# EAGLE design Ver.5 MD Nch (EAGLE 9.6.2)
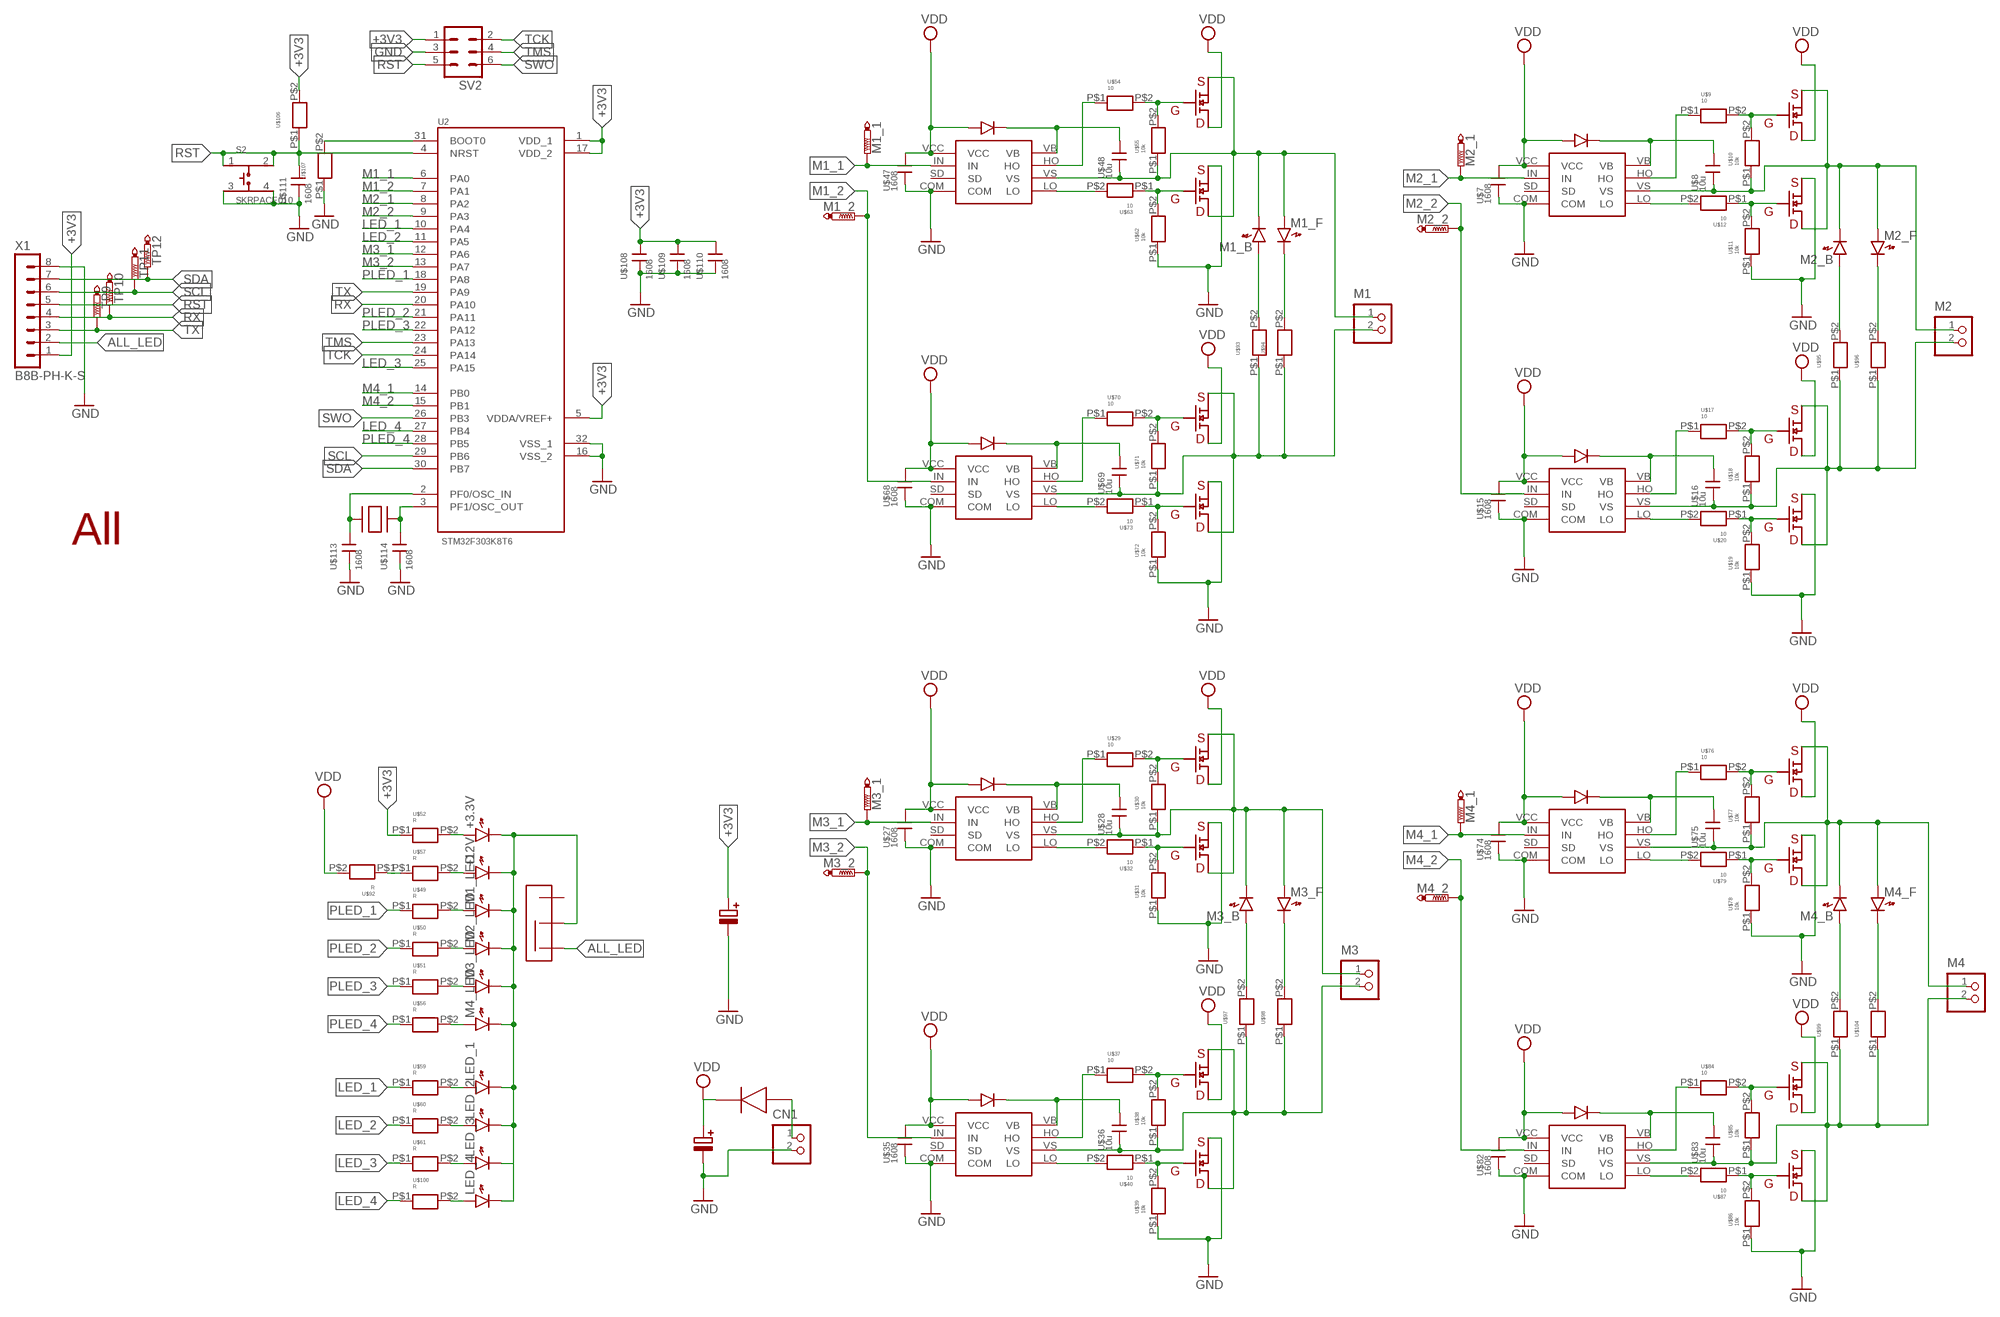
[diagram p0: schematic, sheet 1]

## Parts
+3.3V  LED1608  [LED1608]
+12V  LED1608  [LED1608]
CN1  B2B-XH-A  [B2B-XH-A]
LED_1  LED1608  [LED1608]
LED_2  LED1608  [LED1608]
LED_3  LED1608  [LED1608]
LED_4  LED1608  [LED1608]
M1  S2B-XH-A  [S2B-XH-A]
M1_1  PTR1B1,27  [B1,27]
M1_2  PTR1B1,27  [B1,27]
M1_B  LED1608  [LED1608]
M1_F  LED1608  [LED1608]
M1_LED  LED1608  [LED1608]
M2  S2B-XH-A  [S2B-XH-A]
M2_1  PTR1B1,27  [B1,27]
M2_2  PTR1B1,27  [B1,27]
M2_B  LED1608  [LED1608]
M2_F  LED1608  [LED1608]
M2_LED  LED1608  [LED1608]
M3  S2B-XH-A  [S2B-XH-A]
M3_1  PTR1B1,27  [B1,27]
M3_2  PTR1B1,27  [B1,27]
M3_B  LED1608  [LED1608]
M3_F  LED1608  [LED1608]
M3_LED  LED1608  [LED1608]
M4  S2B-XH-A  [S2B-XH-A]
M4_1  PTR1B1,27  [B1,27]
M4_2  PTR1B1,27  [B1,27]
M4_B  LED1608  [LED1608]
M4_F  LED1608  [LED1608]
M4_LED  LED1608  [LED1608]
S2  SKRPACE010  [SW_SKRPACE010]
SV2  ML6  [ML6]
TP9  PTR1B1,27  [B1,27]
TP10  PTR1B1,27  [B1,27]
TP11  PTR1B1,27  [B1,27]
TP12  PTR1B1,27  [B1,27]
U2  STM32F303K8T6  [QFP80P900X900X160-32N]
U$1  SSM6K8  [SSM6K8]
U$2  SSM6K8  [SSM6K8]
U$3  SSM6K8  [SSM6K8]
U$4  SSM6K8  [SSM6K8]
U$5  IR2302  [IR2302]
U$6  1N4148  [1N4148]
U$7  1608  [CON]
U$8  10u  1608  [CON]
U$9  10  R  [1608]
U$10  10k  R  [1608]
U$11  10k  R  [1608]
U$12  10  R  [1608]
U$13  IR2302  [IR2302]
U$14  1N4148  [1N4148]
U$15  1608  [CON]
U$16  10u  1608  [CON]
U$17  10  R  [1608]
U$18  10k  R  [1608]
U$19  10k  R  [1608]
U$20  10  R  [1608]
U$21  SSM6K8  [SSM6K8]
U$22  SSM6K8  [SSM6K8]
U$23  SSM6K8  [SSM6K8]
U$24  SSM6K8  [SSM6K8]
U$25  IR2302  [IR2302]
U$26  1N4148  [1N4148]
U$27  1608  [CON]
U$28  10u  1608  [CON]
U$29  10  R  [1608]
U$30  10k  R  [1608]
U$31  10k  R  [1608]
U$32  10  R  [1608]
U$33  IR2302  [IR2302]
U$34  1N4148  [1N4148]
U$35  1608  [CON]
U$36  10u  1608  [CON]
U$37  10  R  [1608]
U$38  10k  R  [1608]
U$39  10k  R  [1608]
U$40  10  R  [1608]
U$41  SSM6K8  [SSM6K8]
U$42  SSM6K8  [SSM6K8]
U$43  SSM6K8  [SSM6K8]
U$44  SSM6K8  [SSM6K8]
U$45  IR2302  [IR2302]
U$46  1N4148  [1N4148]
U$47  1608  [CON]
U$48  10u  1608  [CON]
U$49  R  [1608]
U$50  R  [1608]
U$51  R  [1608]
U$52  R  [1608]
U$53  SSW  [SSW]
U$54  10  R  [1608]
U$55  10k  R  [1608]
U$56  R  [1608]
U$57  R  [1608]
U$58  25V100  [25V100]
U$59  R  [1608]
U$60  R  [1608]
U$61  R  [1608]
U$62  10k  R  [1608]
U$63  10  R  [1608]
U$64  IR2302  [IR2302]
U$65  1N4148  [1N4148]
U$66  IR2302  [IR2302]
U$67  1N4148  [1N4148]
U$68  1608  [CON]
U$69  10u  1608  [CON]
U$70  10  R  [1608]
U$71  10k  R  [1608]
U$72  10k  R  [1608]
U$73  10  R  [1608]
U$74  1608  [CON]
U$75  10u  1608  [CON]
U$76  10  R  [1608]
U$77  10k  R  [1608]
U$78  10k  R  [1608]
U$79  10  R  [1608]
U$80  IR2302  [IR2302]
U$81  1N4148  [1N4148]
U$82  1608  [CON]
U$83  10u  1608  [CON]
U$84  10  R  [1608]
U$85  10k  R  [1608]
U$86  10k  R  [1608]
U$87  10  R  [1608]
U$88  SSM6K8  [SSM6K8]
U$89  SSM6K8  [SSM6K8]
U$90  SSM6K8  [SSM6K8]
U$91  SSM6K8  [SSM6K8]
U$92  R  [1608]
U$93  R  [1608]
U$94  R  [1608]
U$95  R  [1608]
U$96  R  [1608]
U$97  R  [1608]
U$98  R  [1608]
U$99  R  [1608]
U$100  R  [1608]
U$101  25V100  [25V100]
U$102  40V5A  [40V5A]
U$103  ALL  [ALL]
U$104  R  [1608]
U$106  R  [1608]
U$107  R  [1608]
U$108  1608  [CON]
U$109  1608  [CON]
U$110  1608  [CON]
U$111  1608  [CON]
U$112  SUISYOU  [水晶]
U$113  1608  [CON]
U$114  1608  [CON]
X1  B8B-PH-K-S  [B8B-PH-K-S]

## Nets
+3V3 [New Class]: SV2.1 U2.1(VDD_1) U2.5(VDDA/VREF+) U2.17(VDD_2) U$52.P$1 U$58.P$1 U$106.P$2 U$108.P$1 U$109.P$1 U$110.P$1 X1.1
ALL_LED [New Class]: U$53.P$1 X1.2
GND [New Class]: CN1.2 S2.3 S2.4 SV2.3 U2.16(VSS_2) U2.32(VSS_1) U$2.S U$4.S U$5.COM U$7.P$2 U$11.P$1 U$13.COM U$15.P$2 U$19.P$1 U$22.S U$24.S U$25.COM U$27.P$2 U$31.P$1 U$33.COM U$35.P$2 U$39.P$1 U$42.S U$44.S U$45.COM U$47.P$2 U$58.P$2 U$62.P$1 U$64.COM U$66.COM U$68.P$2 U$72.P$1 U$74.P$2 U$78.P$1 U$80.COM U$82.P$2 U$86.P$1 U$89.S U$91.S U$101.P$2 U$107.P$1 U$108.P$2 U$109.P$2 U$110.P$2 U$111.P$2 U$113.P$2 U$114.P$2 X1.8
LED_1: U2.10(PA4) U$59.P$1
LED_2: U2.11(PA5) U$60.P$1
LED_3: U2.25(PA15) U$61.P$1
LED_4: U2.27(PB4) U$100.P$1
M1_1 [New Class]: M1_1.TP U2.6(PA0) U$45.IN
M1_2 [New Class]: M1_2.TP U2.7(PA1) U$66.IN
M2_1 [New Class]: M2_1.TP U2.8(PA2) U$5.IN
M2_2 [New Class]: M2_2.TP U2.9(PA3) U$13.IN
M3_1 [New Class]: M3_1.TP U2.12(PA6) U$25.IN
M3_2 [New Class]: M3_2.TP U2.13(PA7) U$33.IN
M4_1 [New Class]: M4_1.TP U2.14(PB0) U$64.IN
M4_2 [New Class]: M4_2.TP U2.15(PB1) U$80.IN
N$1: M1.2 U$3.S U$4.D U$4.DD(D) U$4.DDD(D) U$4.DDDD(D) U$66.VS U$69.P$2 U$71.P$1 U$93.P$1 U$94.P$1
N$2: U$5.VB U$6.P$2 U$8.P$1
N$3: M2.1 M2_B.K M2_F.A U$5.VS U$8.P$2 U$10.P$1 U$21.S U$22.D U$22.DD(D) U$22.DDD(D) U$22.DDDD(D)
N$4: U$9.P$2 U$10.P$2 U$21.G
N$5: M1_LED.A U$49.P$2
N$6: U$5.HO U$9.P$1
N$7: U$5.LO U$12.P$2
N$8: U$11.P$2 U$12.P$1 U$22.G
N$9: U$13.VB U$14.P$2 U$16.P$1
N$10: U$17.P$2 U$18.P$2 U$23.G
N$11: U$13.HO U$17.P$1
N$12: U$13.LO U$20.P$2
N$13: U$19.P$2 U$20.P$1 U$24.G
N$14: M2.2 U$13.VS U$16.P$2 U$18.P$1 U$23.S U$24.D U$24.DD(D) U$24.DDD(D) U$24.DDDD(D) U$95.P$1 U$96.P$1
N$15: U$25.VB U$26.P$2 U$28.P$1
N$16: M3.1 M3_B.K M3_F.A U$25.VS U$28.P$2 U$30.P$1 U$41.S U$42.D U$42.DD(D) U$42.DDD(D) U$42.DDDD(D)
N$17: U$29.P$2 U$30.P$2 U$41.G
N$18: M2_LED.A U$50.P$2
N$19: U$25.HO U$29.P$1
N$20: U$25.LO U$32.P$2
N$21: M3_LED.A U$51.P$2
N$22: U$31.P$2 U$32.P$1 U$42.G
N$23: U$33.VB U$34.P$2 U$36.P$1
N$24: U$37.P$2 U$38.P$2 U$43.G
N$25: U$33.HO U$37.P$1
N$26: U$33.LO U$40.P$2
N$27: U$39.P$2 U$40.P$1 U$44.G
N$28: +3.3V.A U$52.P$2
N$29: CN1.1 U$102.P$1
N$30: +12V.A U$57.P$2
N$31: M3.2 U$33.VS U$36.P$2 U$38.P$1 U$43.S U$44.D U$44.DD(D) U$44.DDD(D) U$44.DDDD(D) U$97.P$1 U$98.P$1
N$32: U$64.VB U$65.P$2 U$75.P$1
N$33: LED_1.A U$59.P$2
N$34: M4_LED.A U$56.P$2
N$35: U$45.VB U$46.P$2 U$48.P$1
N$36: M1.1 M1_B.K M1_F.A U$1.S U$2.D U$2.DD(D) U$2.DDD(D) U$2.DDDD(D) U$45.VS U$48.P$2 U$55.P$1
N$37: LED_3.A U$61.P$2
N$38: LED_2.A U$60.P$2
N$39: U$1.G U$54.P$2 U$55.P$2
N$40: U$45.HO U$54.P$1
N$41: U$45.LO U$63.P$2
N$42: U$2.G U$62.P$2 U$63.P$1
N$43: U$66.VB U$67.P$2 U$69.P$1
N$44: M4.1 M4_B.K M4_F.A U$64.VS U$75.P$2 U$77.P$1 U$88.S U$89.D U$89.DD(D) U$89.DDD(D) U$89.DDDD(D)
N$45: U$3.G U$70.P$2 U$71.P$2
N$46: U$66.HO U$70.P$1
N$47: U$66.LO U$73.P$2
N$48: U$4.G U$72.P$2 U$73.P$1
N$49: U$76.P$2 U$77.P$2 U$88.G
N$50: U$64.HO U$76.P$1
N$51: U$64.LO U$79.P$2
N$52: U$78.P$2 U$79.P$1 U$89.G
N$53: U$80.VB U$81.P$2 U$83.P$1
N$54: U$84.P$2 U$85.P$2 U$90.G
N$55: U$80.HO U$84.P$1
N$56: U$80.LO U$87.P$2
N$57: U$86.P$2 U$87.P$1 U$91.G
N$58: M4.2 U$80.VS U$83.P$2 U$85.P$1 U$90.S U$91.D U$91.DD(D) U$91.DDD(D) U$91.DDDD(D) U$99.P$1 U$104.P$1
N$59: U$57.P$1 U$92.P$1
N$60: M1_B.A U$93.P$2
N$61: M1_F.K U$94.P$2
N$62: M2_B.A U$95.P$2
N$63: +3.3V.K +12V.K LED_1.K LED_2.K LED_3.K LED_4.K M1_LED.K M2_LED.K M3_LED.K M4_LED.K U$53.P$3
N$65: LED_4.A U$100.P$2
N$68: M3_B.A U$97.P$2
N$69: M2_F.K U$96.P$2
N$70: M4_B.A U$99.P$2
N$71: M4_F.K U$104.P$2
N$72: M3_F.K U$98.P$2
N$86: U2.31(BOOT0) U$107.P$2
N$87: U2.2(PF0/OSC_IN) U$112.P$1 U$113.P$1
N$88: U2.3(PF1/OSC_OUT) U$112.P$2 U$114.P$1
PLED_1: U2.18(PA8) U$49.P$1
PLED_2: U2.21(PA11) U$50.P$1
PLED_3: U2.22(PA12) U$51.P$1
PLED_4: U2.28(PB5) U$56.P$1
RST: S2.1 S2.2 SV2.5 U2.4(NRST) U$106.P$1 U$111.P$1 X1.5
RX: TP10.TP U2.20(PA10) X1.4
SCL: TP11.TP U2.29(PB6) X1.6
SDA: TP12.TP U2.30(PB7) X1.7
SWO: SV2.6 U2.26(PB3)
TCK: SV2.2 U2.24(PA14)
TMS: SV2.4 U2.23(PA13)
TX: TP9.TP U2.19(PA9) X1.3
VDD [New Class]: U$1.D U$1.DD(D) U$1.DDD(D) U$1.DDDD(D) U$3.D U$3.DD(D) U$3.DDD(D) U$3.DDDD(D) U$5.VCC U$6.P$1 U$7.P$1 U$13.VCC U$14.P$1 U$15.P$1 U$21.D U$21.DD(D) U$21.DDD(D) U$21.DDDD(D) U$23.D U$23.DD(D) U$23.DDD(D) U$23.DDDD(D) U$25.VCC U$26.P$1 U$27.P$1 U$33.VCC U$34.P$1 U$35.P$1 U$41.D U$41.DD(D) U$41.DDD(D) U$41.DDDD(D) U$43.D U$43.DD(D) U$43.DDD(D) U$43.DDDD(D) U$45.VCC U$46.P$1 U$47.P$1 U$64.VCC U$65.P$1 U$66.VCC U$67.P$1 U$68.P$1 U$74.P$1 U$80.VCC U$81.P$1 U$82.P$1 U$88.D U$88.DD(D) U$88.DDD(D) U$88.DDDD(D) U$90.D U$90.DD(D) U$90.DDD(D) U$90.DDDD(D) U$92.P$2 U$101.P$1 U$102.P$2
Unconnected: U$5.SD U$13.SD U$25.SD U$33.SD U$45.SD U$53.P$2 U$64.SD U$66.SD U$80.SD

## Library data of the parts
+3.3V +12V LED_1-LED_4 M1_B M1_F M1_LED M2_B M2_F M2_LED M3_B M3_F M3_LED M4_B M4_F M4_LED = generic:LED: Generic LEDs
CN1 = jst-xh:B2B-XH-A: Wire-to-Board 2.5mm pitch top mount connector Source: http://www.jst-mfg.com/product/pdf/jpn/XH.pdf http://www.jst-mfg.com/product/detail.php?series=277
M1-M4 = jst-xh:S2B-XH-A: Wire-to-Board 2.5mm pitch side mount connector Source: http://www.jst-mfg.com/product/pdf/jpn/XH.pdf http://www.jst-mfg.com/product/detail.php?series=277
M1_1 M1_2 M2_1 M2_2 M3_1 M3_2 M4_1 M4_2 TP9-TP12 = testpad:PTR1: TEST PIN
S2 = SKRPACE010:SKRPACE010: Switch Tactile N.O. SPST Button J-Bend 0.05A 16VDC 2.55N SMD Automotive T/R Check prices <https://pricing.snapeda.com/parts/SKRPACE010/ALPS/view-part?ref=eda>; AVAILABILITY: In Stock; DESCRIPTION: Switch Tactile N.O. SPST Button J-Bend 0.05A 16VDC 2.55N SMD Automotive T/R; MF: ALPS; MP: SKRPACE010; PACKAGE: None; PRICE: None
SV2 = con-ml:ML6: HARTING; OC_FARNELL: unknown; OC_NEWARK: unknown
U2 = STM32F303K8T6:STM32F303K8T6: Analog and DSP with FPU ARM Cortex-M4 MCU with 64 Kbytes Flash, 72 MHz CPU, CCM, 12-bit ADC 5 MSPS, comparators, op-amp Check availability <https://pricing.snapeda.com/parts/STM32F303K8T6/STMicroelectronics/view-part?ref=eda>; AVAILABILITY: In Stock; DESCRIPTION: ARM® Cortex®-M4 STM32F3 Microcontroller IC 32-Bit 72MHz 64KB (64K x 8) FLASH 32-LQFP (7x7); MF: STMicroelectronics; MP: STM32F303K8T6; PACKAGE: LQFP-32 STMicroelectronics; PRICE: None; PURCHASE-URL: https://pricing.snapeda.com/search/part/STM32F303K8T6/?ref=eda
U$1-U$4 U$21-U$24 U$41-U$44 U$88-U$91 = NchMOSFET SSM6K819R:SSM6K8
U$5 U$13 U$25 U$33 U$45 U$64 U$66 U$80 = IR2302:IR2302
U$6 U$14 U$26 U$34 U$46 U$65 U$67 U$81 = 1N4148:1N4148
U$7 U$8 U$15 U$16 U$27 U$28 U$35 U$36 U$47 U$48 U$68 U$69 U$74 U$75 U$82 U$83 U$108-U$111 U$113 U$114 = con1608:1608
U$9-U$12 U$17-U$20 U$29-U$32 U$37-U$40 U$49-U$52 U$54-U$57 U$59-U$63 U$70-U$73 U$76-U$79 U$84-U$87 U$92-U$100 U$104 U$106 U$107 = R 1608:R
U$53 = SSW:SSW
U$58 U$101 = 100uF25V 電解:25V100
U$102 = D40V5A:40V5A
U$103 = All_outlook:ALL
U$112 = 水晶:SUISYOU
X1 = con-JST PH:B8B-PH: JST PH series header 2.00mm pitch disconnectable crimp style connectors, vertical (side entry type), 8 pins

## Net classes
1 New Class: width 0.279 mm

## Board
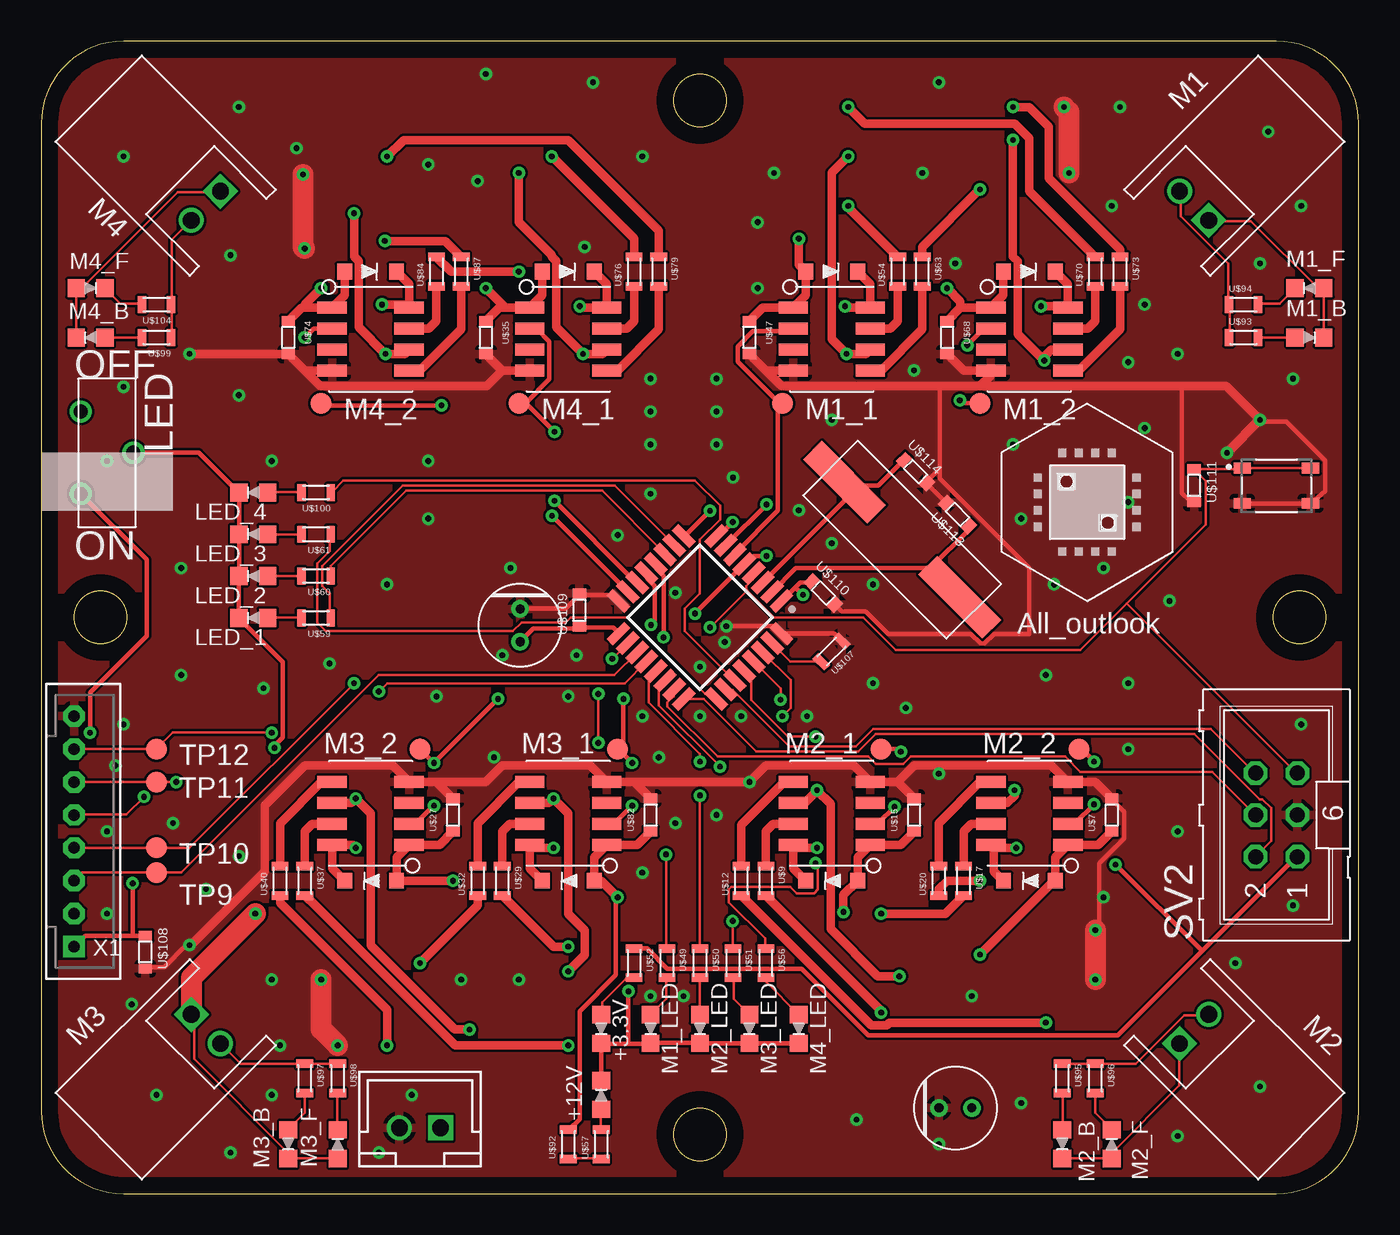
[diagram p1: board, top side]
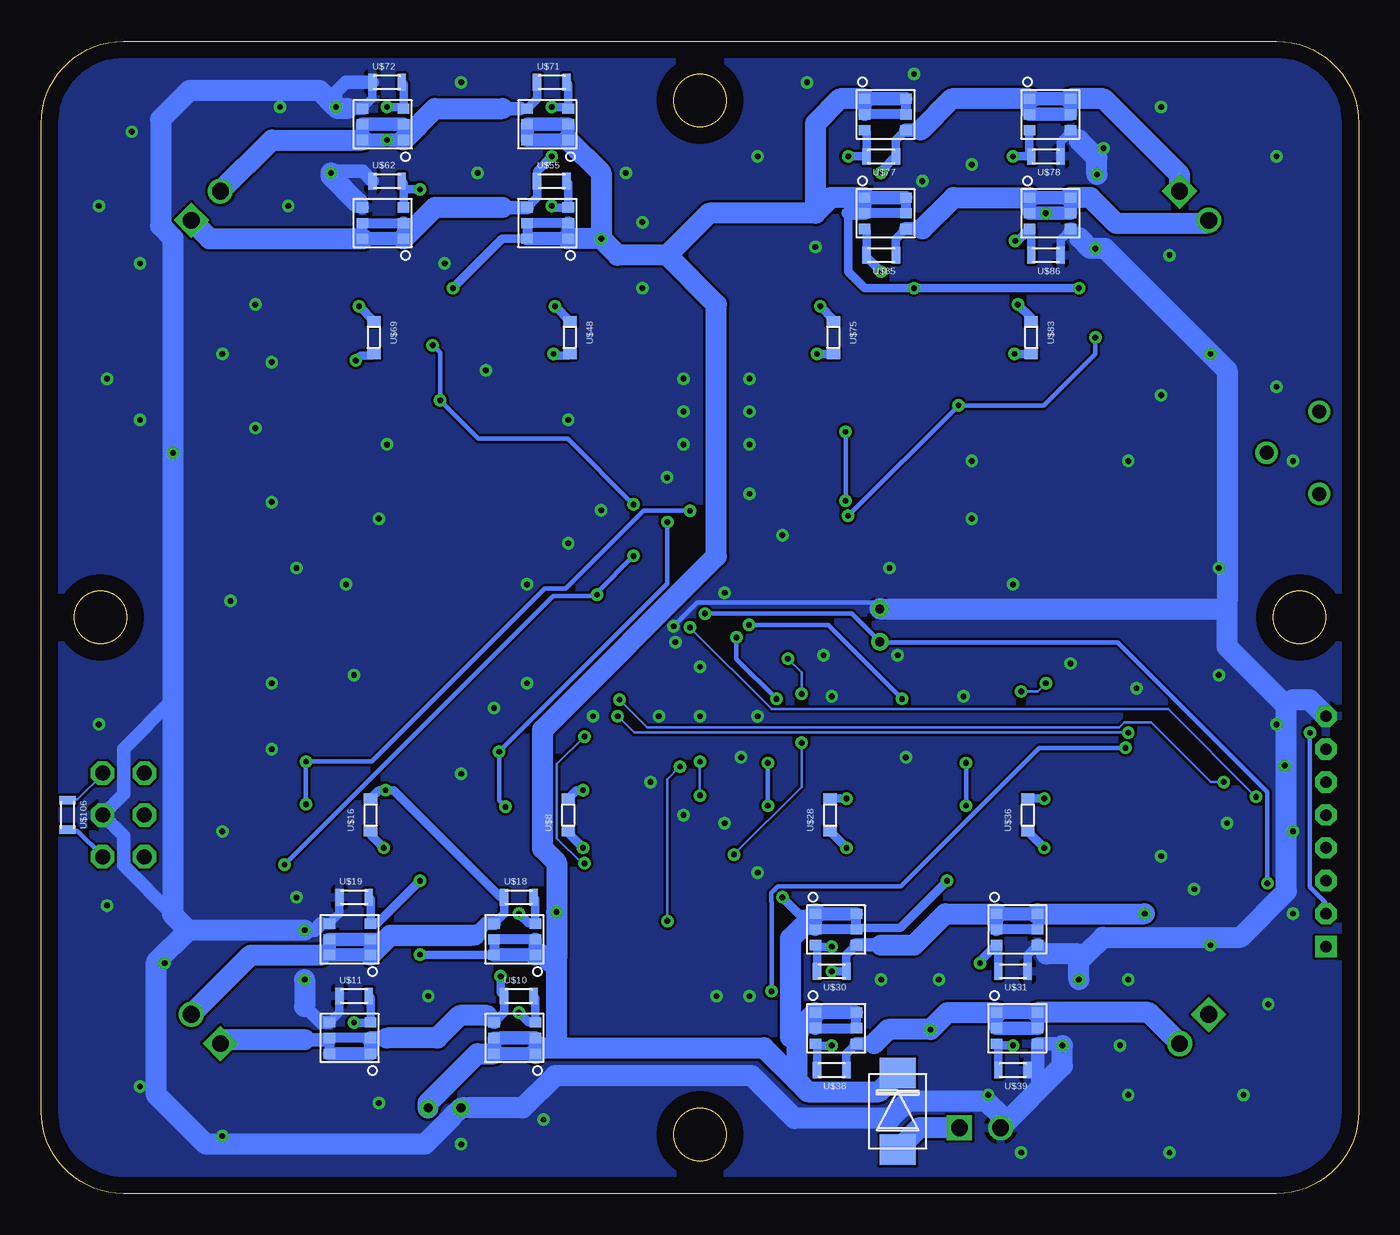
[diagram p2: board, bottom side, seen from below]

Size 80 x 70 mm. Coordinates in mm from the lower left corner, seen from the top.
Outline: 5,0 75,0 arc90 80,5 80,65 arc90 75,70 5,70 arc90 0,65 0,5 arc90 5,0
Outline: circle at 40,66.4 radius 1.6
Outline: circle at 40,3.6 radius 1.6
Outline: circle at 3.6,35 radius 1.6
Outline: circle at 76.4,35 radius 1.6
Copper layers (1*16): Top 0.035mm / dielectric 1.5mm / Bottom 0.035mm
Design rules "default": minimum track width 6mil, minimum drill 0.35mm, track to track 6mil, track to pad 6mil, pad to pad 6mil, via to via 6mil, smd to smd 6mil, copper to edge 40mil, drill to drill 6mil, minimum pad ring 10mil, minimum via ring 8mil, stop-mask expansion 4mil, vias tented up to drill 0mil, thermal gap 10mil

### Footprints (pad centres in the part's own frame; a part is rotated, then mirrored left to right if it is on the bottom)
LED1608 = smd 1.05 x 1.08: A -0.875,0; K 0.875,0
B2B-XH-A = drill 1.016 square: 1 -1.25,0 | drill 1.016: 2 1.25,0
S2B-XH-A = drill 1.016 square: 1 1.25,0 | drill 1.016: 2 -1.25,0
B1,27 = smd 1.27 x 1.27: TP 0,0
SW_SKRPACE010 = smd 1.05 x 0.65: 1 -2.075,1.075; 2 2.075,1.075; 3 -2.075,-1.075; 4 2.075,-1.075
ML6 = drill 0.914 octagon: 1 -2.54,-1.27; 2 -2.54,1.27; 3 0,-1.27; 4 0,1.27; 5 2.54,-1.27; 6 2.54,1.27
QFP80P900X900X160-32N = smd 1.5 x 0.55: 1 -4.2,2.8; 2 -4.2,2; 3 -4.2,1.2; 4 -4.2,0.4; 5 -4.2,-0.4; 6 -4.2,-1.2; 7 -4.2,-2; 8 -4.2,-2.8; 17 4.2,-2.8; 18 4.2,-2; 19 4.2,-1.2; 20 4.2,-0.4; 21 4.2,0.4; 22 4.2,1.2; 23 4.2,2; 24 4.2,2.8 | smd 0.55 x 1.5: 9 -2.8,-4.2; 10 -2,-4.2; 11 -1.2,-4.2; 12 -0.4,-4.2; 13 0.4,-4.2; 14 1.2,-4.2; 15 2,-4.2; 16 2.8,-4.2; 25 2.8,4.2; 26 2,4.2; 27 1.2,4.2; 28 0.4,4.2; 29 -0.4,4.2; 30 -1.2,4.2; 31 -2,4.2; 32 -2.8,4.2
SSM6K8 = smd 0.62 x 0.7: D 0,0; DD 0.95,0; DDD 0.95,2.5; DDDD 0,2.5; G 1.9,0; S 1.9,2.5
IR2302 = smd 1.78 x 0.72: COM -2.34,0; HO 2.34,2.54; IN -2.34,2.54; LO 2.34,0; SD -2.34,1.27; VB 2.34,3.81; VCC -2.34,3.81; VS 2.34,1.27
1N4148 = smd 0.9 x 0.95: P$1 -1.575,0; P$2 1.575,0
CON = smd 0.6 x 0.813: P$1 -1,0; P$2 1,0
1608 = smd 0.508 x 1.016: P$1 -0.889,0; P$2 0.889,0
SSW = drill 0.85: P$1 -2.5,1.6; P$2 2.5,1.6; P$3 0,-1.6
25V100 = drill 0.55: P$1 -1,0; P$2 1,0
40V5A = smd 1.85 x 2.2: P$1 -2.325,0; P$2 2.325,0
水晶 = smd 5.5 x 1.6: P$1 1.2,2.35; P$2 11.1,2.35
B8B-PH-K-S = drill 0.7 pad 1.3 square: 1 7,0 | drill 0.7 pad 1.3 octagon: 2 5,0; 3 3,0; 4 1,0; 5 -1,0; 6 -3,0; 7 -5,0; 8 -7,0

### Placement (x,y rotation side)
+3.3V  34,10 270 top
+12V  34,6 90 top
CN1  23,4 180 top
LED_1  12.88,34.97 180 top
LED_2  12.88,37.51 180 top
LED_3  12.88,40.05 180 top
LED_4  12.88,42.59 180 top
M1  70,60 315 top
M1_1  45,48 0 top
M1_2  57,48 0 top
M1_B  77,52 0 top
M1_F  77,55 180 top
M1_LED  37,10 270 top
M2  70,10 225 top
M2_1  51,27 0 top
M2_2  63,27 0 top
M2_B  62,3 270 top
M2_F  65,3 90 top
M2_LED  40,10 270 top
M3  10,10 135 top
M3_1  35,27 0 top
M3_2  23,27 0 top
M3_B  15,3 270 top
M3_F  18,3 90 top
M3_LED  43,10 270 top
M4  10,60 45 top
M4_1  29,48 180 top
M4_2  17,48 180 top
M4_B  3,52 180 top
M4_F  3,55 0 top
M4_LED  46,10 270 top
S2  75,43 0 top
SV2  75,23 90 top
TP9  7,19.5 270 top
TP10  7,21 0 top
TP11  7,25 0 top
TP12  7,27 0 top
U2  40,35 225 top
U$1  48,58 90 bottom
U$2  58,58 90 bottom
U$3  48,64 90 bottom
U$4  58,64 90 bottom
U$5  48,25 180 top
U$6  48,19 180 top
U$7  65,23 90 top
U$8  48,23 90 bottom
U$9  44,19 270 top
U$10  51,12 0 bottom
U$11  61,12 0 bottom
U$12  42.5,19 90 top
U$13  60,25 180 top
U$14  60,19 180 top
U$15  53,23 90 top
U$16  60,23 90 bottom
U$17  56,19 270 top
U$18  51,18 0 bottom
U$19  61,18 0 bottom
U$20  54.5,19 90 top
U$21  50,8.5 90 bottom
U$22  60,8.5 90 bottom
U$23  50,14.5 90 bottom
U$24  60,14.5 90 bottom
U$25  32,25 180 top
U$26  32,19 180 top
U$27  25,23 90 top
U$28  32.1,23 90 bottom
U$29  28,19 270 top
U$30  32,13.5 180 bottom
U$31  21,13.5 180 bottom
U$32  26.5,19 90 top
U$33  20,25 180 top
U$34  20,19 180 top
U$35  27,52 270 top
U$36  20.1,23 90 bottom
U$37  16,19 270 top
U$38  32,7.5 180 bottom
U$39  21,7.5 180 bottom
U$40  14.5,19 90 top
U$41  33,17 270 bottom
U$42  22,17 270 bottom
U$43  33,11 270 bottom
U$44  22,11 270 bottom
U$45  48,50 0 top
U$46  48,56 0 top
U$47  43,52 270 top
U$48  47.9,52 270 bottom
U$49  38,14 270 top
U$50  40,14 270 top
U$51  42,14 270 top
U$52  36,14 270 top
U$53  4,45 90 top
U$54  52,56 90 top
U$55  49,61.5 0 bottom
U$56  44,14 270 top
U$57  34,3 90 top
U$58  29.08,34.52 90 top
U$59  16.69,34.97 180 top
U$60  16.69,37.51 180 top
U$61  16.69,40.05 180 top
U$62  59,61.5 0 bottom
U$63  53.5,56 270 top
U$64  32,50 0 top
U$65  32,56 0 top
U$66  60,50 0 top
U$67  60,56 0 top
U$68  55,52 270 top
U$69  59.8,52 270 bottom
U$70  64,56 90 top
U$71  49,67.5 0 bottom
U$72  59,67.5 0 bottom
U$73  65.5,56 270 top
U$74  15,52 270 top
U$75  31.9,52 270 bottom
U$76  36,56 90 top
U$77  29,63 180 bottom
U$78  19,63 180 bottom
U$79  37.5,56 270 top
U$80  20,50 0 top
U$81  20,56 0 top
U$82  37,23 90 top
U$83  19.9,52 270 bottom
U$84  24,56 90 top
U$85  29,57 180 bottom
U$86  19,57 180 bottom
U$87  25.5,56 270 top
U$88  30,66.5 270 bottom
U$89  20,66.5 270 bottom
U$90  30,60.5 270 bottom
U$91  20,60.5 270 bottom
U$92  32,3 90 top
U$93  73,52 0 top
U$94  73,54 0 top
U$95  62,7 270 top
U$96  64,7 270 top
U$97  16,7 270 top
U$98  18,7 270 top
U$99  7,52 180 top
U$100  16.69,42.59 180 top
U$101  55.51,5.21 180 top
U$102  28,5 90 bottom
U$103  63.5,42 0 top
U$104  7,54 180 top
U$106  78.4,23 270 bottom
U$107  47.99,32.93 225 top
U$108  6.32,14.67 270 top
U$109  32.68,35.44 90 top
U$110  47.49,36.48 315 top
U$111  70,43 270 top
U$112  58.28,37.03 135 top
U$113  55.64,41.25 135 top
U$114  53.09,43.85 315 top
X1  2,22 270 top

### Tracks (layer width: path | path; a pad name or v marks a point on that pad's centre or on a via)
+3V3  (via drill 0.35)
  Top 0.279: 70.48,14.73 76.19,20.45 SV2.1 | 70.48,14.73 65.38,9.62 50.21,9.62 46.17,13.66 38.02,13.66 36.8,14.88 36.04,14.88 U$52.P$1 | 5.56,15.64 2.66,15.64 2.05,15.04 X1.1 | 5.56,15.64 6.32,15.64 U$108.P$1 | 45.79,36.83 U2.1 | 45.79,36.83 46.1,37.13 46.78,37.13 U$110.P$1 | U2.17 35.05,34.09 34.74,34.39 32.69,34.39 U$109.P$1 32.61,34.31 29.87,34.31 29.1,33.55 U$58.P$1 | v39.7,35.23 42.67,38.2 U2.5 42.82,38.28 43.28,38.73 v44.04,38.73 | v46.25,36.37 45.79,36.83 | v5.56,18.85 5.56,15.64 | v65.22,19.99 70.48,14.73
  Bottom 0.279: U$106.P$2 78.33,22.05 77.8,22.05 76.27,20.52 SV2.1 | v39.7,35.23 30.78,35.23 29.1,33.55 U$58.P$1 28.95,33.48 14.62,33.48 5.56,24.41 v5.56,18.85 | v44.04,38.73 46.25,36.52 v46.25,36.37 46.33,36.3 48.91,36.3 v65.22,19.99
ALL_LED  (via drill 0.35)
  Top 0.279: v2.97,27.99 2.97,30.43 6.4,33.86 6.4,38.51 U$53.P$1
  Bottom 0.279: v2.97,27.99 2.97,18.62 2.05,17.7 2.05,17.02 X1.2
GND  (via drill 0.35)
  Top 0.279: U$113.P$2 53.8,43.09 U$114.P$2 53.8,43.28 54.55,44.04 | 69.26,49.04 69.26,42.54 69.69,42.12 U$111.P$2 | v74,47 74.21,46.89 75.59,46.89 77.95,44.53 77.95,42.67 S2.4 S2.3 | U2.16 34.67,36.37 32.69,36.37 U$109.P$2 32.61,36.3 31.85,35.53 29.1,35.53 U$58.P$2 | U$108.P$2 6.4,13.74 7.46,13.74 8.76,15.04 v9,15.1 | v64,16 64.23,16.33 64.23,20.06 65.76,21.59 65.76,23.19 65.15,23.8 U$7.P$2 | v41.6,34.47 44.5,34.47 44.88,34.09 U2.32 48.16,34.01 U$107.P$1 | U$110.P$2 48.6,35.37 50.06,35.37 51.43,34 56.44,34 57.03,33.41 57.27,33.41 57.86,34 60,34 60,38 54.55,43.45 54.55,44.04 | 54.55,44.04 54.55,49.04
  Top 0.508: 24,25 U$33.COM 21.34,26 16,26 13.59,23.59 13.59,19.59 9.1,15.1 v9,15.1 | U$27.P$2 24,25 | U$25.COM 36,25 U$82.P$2 | 52,25 U$5.COM 49.34,26 44,26 v43,25 U$25.COM | 52,25 U$15.P$2 | U$7.P$2 64,25 U$13.COM 61.34,26 53,26 52,25 | 16,50 U$74.P$2 v9,51 | 16,50 U$80.COM | U$35.P$2 28,50 | 28,50 U$64.COM | U$47.P$2 44,50 | 44,50 U$45.COM | U$68.P$2 56,50 U$66.COM 57.66,49.7 57,49.04 | 24,25 27,25 28,26 33.34,26 U$25.COM | 16,50 16.96,49.04 27.04,49.04 28,50 | 44,50 44.96,49.04 54.55,49.04 57,49.04 | 57,49.04 69.26,49.04 71.96,49.04 v74,47
  Top 0.61: v74,47 v72,45
  Top 1.27: v18,9 17,10 v17,13 | v16,57.4 15.9,57.5 v15.9,61.9 | v62.1,66 62.4,65.7 v62.4,62 | v64,16 v64,13
  Bottom 0.279: 62.98,16.41 62.71,16.25 U$24.S | U$91.S 17.52,58.62 17.48,58.59 | 19.43,9.09 U$44.S | U$58.P$2 29.47,35.91 40.15,35.91 v41.6,34.47
  Bottom 0.508: U$78.P$1 18.11,63.89 17.5,64.5 U$89.S | U$86.P$1 18.11,57.96 17.48,58.59 | U$31.P$1 20.11,14.49 U$42.S | U$39.P$1 19.5,8.11 19.5,9.09 | U$19.P$1 61.89,17.01 U$24.S | U$11.P$1 61.89,11.01 U$22.S | U$72.P$1 59.89,66.53 60.5,65.91
  Bottom 0.813: 8,35.53 8,36 | 16.95,58.05 17.48,58.59 | v18,9 18.09,9.09 19.43,9.09 19.5,9.09 19.5,6.25 CN1.2 | 17,14.55 16.55,14.55 | v64,16 63.4,16 62.98,16.41 | 72.03,16.97 75,19.93 75,21.73 SV2.3 75,24.27 75,27 72,30 | 61.4,65.91 60.5,65.91 | v62.1,66 62.1,66.9 61.5,67.5 U$72.P$1 | U$62.P$1 60.49,62.1 62.3,62.1 v62.4,62 | 17.5,64.5 17,64 | 18.95,14.55 U$42.S | U$2.S 60.8,60.2 | U$22.S 63.04,10.4 | 63.04,10.4 64,11.36 | U$22.S 63.04,10.4 | 63.04,10.4 64,11.36 | U$22.S 63.04,10.4 | 63.04,10.4 64,11.36
  Bottom 1.27: U$101.P$2 50.77,5.2 48.8,7.17 36.87,7.17 34.27,4.57 28.44,4.57 27.4,5.61 22.61,5.61 21.75,4.75 CN1.2 18,7.75 v18,9 | v17,13 17,14.1 16.55,14.55 15.52,15.58 7.18,15.58 4.39,18.36 4.39,29.61 | 17,14.55 18.95,14.55 | X1.8 3,30 4,30 4.39,29.61 | U$58.P$2 8.01,35.52 8,35.53 | 4.39,29.61 8,33.22 8,36 8,50 v9,51 15.4,57.4 v16,57.4 16.3,57.4 16.95,58.05 | v15.9,61.9 15.9,62.9 17,64 | v62.4,62 62.4,61.8 60.8,60.2 | 61.4,65.91 62.02,65.91 v62.1,66 63.1,67 71,67 72.75,65.25 72.75,58.79 72,58.04 v72,45 72,30 72,17 72.03,16.97 71.07,16 | U$101.P$2 55.09,4.63 55.09,4.62 56.71,3 70,3 73,6 73,14.07 71.07,16 | v64,13 64,11.36 | v64,16 71.07,16
  other vias: 35,40 37,42.5 42,43.5 46,41.5 48,39.5 50.5,37 41.5,33.5 38.5,36.5 40,32 40,29 37.5,26.5 36.5,29 46.5,29 50.5,31 54.5,25.5 66,27 66,31 64.5,38 68.5,36 72.5,14 69,3.5 54.5,3 59.5,5.5 49.5,4.5 56.5,12 64.5,18 69,22 74,6.5 22.5,6 20.5,2.5 11.5,2.5 14,6 14.5,9 14,13 7,6 5.5,11.5 10,18.5 25.5,13 29,13 36.5,19.5 38.5,22.5 41,23 37,12 39,12 42.5,29 27.5,26.5 12,20.5 4,17 4,22 8,22.5 4.5,26 5,28.5 8.5,31.5 8.5,38 21,37 28.5,38 23.5,41 23.5,44.5 14,44.5 4,44.5 5,49 12,48.5 11.5,57 5,63 12,66 15.5,63.5 23.5,62.5 27,68 33.5,67.5 36.5,63 33,57.5 26.5,61.5 37,49.5 37,47.5 37,45.5 41,45.5 41,47.5 41,49.5 48,47 53,50 66,50.5 67,54 65,60 53.5,62 55.5,56.5 44.5,62 43.5,59 43.5,55 54.5,67.5 65.5,66 74.5,64.5 76.5,60 74,56.5 76,49.5 69,51 67,46.5 59,45.5 66,42 59.5,41 61.5,37 61,31.5 76.5,28.5 76,17.5 52.5,29.5 24,30.2 17.5,32.2 13.5,30.7 32,30.2 32.5,32.7 28,32.7
  pour Bottom: 0,0 0,70 80,70 80,0
  pour Top: 0,70 0,0 80,0 80,70
LED_1
  Top 0.152: U$59.P$1 17.52,35 17.52,36.45 17.06,36.91 17.06,38.12 21.94,43 34.82,43 38.4,39.42 U2.10
LED_2
  Top 0.152: U$60.P$1 17.58,38.12 22.16,42.7 34.06,42.7 37.87,38.89 U2.11
LED_3
  Top 0.152: U$61.P$1 17.52,40.03 17.52,39.04 16.76,38.28 16.76,34.7 17.29,34.16 28.65,34.16 29.18,34.7 31.85,34.7 32.15,35 35.66,35 40.3,30.35 40.69,30.35 40.91,30.12 U2.25
LED_4
  Top 0.152: U$100.P$1 17.6,42.62 17.66,42.62 18.35,43.31 39.7,43.31 41.22,41.78 41.22,40.94 40,39.72 40,36.45 39.09,35.53 39.09,34.16 42.06,31.19 U2.27
M1_1
  Top 0.279: U$45.IN 45.64,52.53 45.49,52.37 43.2,52.37 42.29,51.46 42.29,50.55 44.8,48.03 44.95,48.03 M1_1.TP 44.72,47.95 44.72,41.48 42.13,38.89 U2.6
M1_2  (via drill 0.35)
  Top 0.279: v55.77,48.18 55.93,48.03 56.99,48.03 M1_2.TP | v56.23,51.53 57.22,52.53 57.6,52.53 U$66.IN | v44.04,41.86 41.6,39.42 U2.7
  Bottom 0.279: v56.23,51.53 55.77,51.08 v55.77,48.18 53.45,45.86 48.04,45.86 v44.04,41.86
M2_1  (via drill 0.35)
  Top 0.279: v52.19,26.85 52.04,27 51.05,27 M2_1.TP | v51.81,23.49 50.82,22.5 50.36,22.5 U$5.IN | v41.98,40.79 41.14,39.95 U2.8
  Bottom 0.279: v51.81,23.49 52.19,23.88 v52.19,26.85 41.98,37.06 v41.98,40.79
M2_2  (via drill 0.35)
  Top 0.279: v63.93,26.24 63.16,27 63.01,27 M2_2.TP | v63.93,23.65 62.78,22.5 62.4,22.5 U$13.IN | v40.61,41.48 39.09,39.95 U2.9
  Bottom 0.279: v63.93,23.65 v63.93,26.24 59.93,26.24 49.41,36.75 48.15,36.75 43.43,41.48 v40.61,41.48
M3_1  (via drill 0.35)
  Top 0.279: v35.88,26.16 35.05,27 M3_1.TP 35.12,27.07 35.35,27.3 v35.35,30.05 | v35.88,23.57 34.82,22.5 34.36,22.5 U$25.IN | v37.79,33.78 37.79,37.52 37.33,37.97 37.33,38.2 U2.12
  Bottom 0.279: v35.88,23.57 v35.88,26.16 | v37.79,33.78 37.79,32.48 v35.35,30.05
M3_2  (via drill 0.35)
  Top 0.279: v23.85,23.57 22.78,22.5 22.4,22.5 U$33.IN | M3_2.TP v23.85,26.16 v27.73,30.05 | v37.03,34.54 37.26,34.77 37.26,36.91 36.8,37.36 36.8,37.67 U2.13
  Bottom 0.279: v23.85,23.57 v23.85,26.16 | v37.03,34.54 32.23,34.54 v27.73,30.05
M4_1  (via drill 0.35)
  Top 0.279: U$64.IN 29.71,52.53 30.09,52.53 30.86,51.76 30.86,49.48 29.41,48.03 29.03,48.03 M4_1.TP 29.48,47.95 v31.16,46.28 | v31.16,42.09 36.11,37.13 U2.14
  Bottom 0.279: v31.16,46.28 v31.16,42.09
M4_2  (via drill 0.35)
  Top 0.279: v31.01,41.17 35.58,36.6 U2.15 | 17.06,47.88 v24.3,47.88 | v16,52 16.54,52.54 U$80.IN
  Top 0.508: M4_2.TP 17.06,47.94 17.06,47.88
  Bottom 0.279: v31.01,41.17 v24.3,47.88 19.12,47.88 16,51 v16,52
N$1  (via drill 0.35)
  Top 0.152: U$93.P$1 72.16,52.07 72.16,53.97 U$94.P$1 72.08,54.05 72.08,56.49 69.19,59.38 69.19,60.83 M1.2
  Top 0.508: U$66.VS 61.34,51.27 60.9,50.83 v60.9,50.6 59.28,52.22 59.28,56.64 59,56.92 v59,64
  Bottom 0.508: U$71.P$1 49.89,66.51 U$3.S 50.52,65.91 50.9,65.91 | v60.9,50.6 60.6,50.9 59.9,50.9 U$69.P$2
  Bottom 0.813: 52,65.9 50.91,65.9 50.9,65.91 | U$4.D U$4.DD U$4.DDD U$4.DDDD v59,64 U$4.D
  Bottom 1.27: 52,65.9 56.1,65.9 U$4.D | M1.2 66,64 U$4.DDDD
N$2  (via drill 0.35)
  Top 0.508: U$6.P$2 45.66,19.77 U$5.VB 45.85,21 v47.1,21
  Bottom 0.508: U$8.P$1 48,21.9 v47.1,21
N$3  (via drill 0.35)
  Top 0.152: M2_B.K 62.02,2.16 64.99,2.16 M2_F.A 64.99,2.23 64.99,2.46 69.11,6.58 69.11,9.09 M2.1
  Top 0.508: U$5.VS 46.36,23.73 47.1,24.47 v47.1,24.5 47.93,23.67 47.93,16.07 50.8,13.2 v52.1,13.2
  Bottom 0.508: U$21.S 51.89,11.01 U$10.P$1 52.1,12.21 v52.1,13.2 | v47.1,24.5 47.5,24.5 U$8.P$2 | U$22.DDD 62.6,9.35
  Bottom 0.61: U$22.DD U$22.DDD U$22.DDDD
  Bottom 0.813: U$21.S 52.92,10.82 | 55.95,9.45 56,9.45 | 59,9.45 U$22.DD | U$22.DD 60.1,9.35 | U$22.DDDD U$22.D U$22.DD | 62.6,9.35 64,9.35
  Bottom 1.27: 52.92,10.82 54.58,10.82 55.95,9.45 | 56,9.45 59,9.45 | 64,9.35 68.88,9.35 M2.1
N$4  (via drill 0.35)
  Top 0.508: U$9.P$2 51,11.11 v51,11
  Bottom 0.508: U$10.P$2 50,11.89 U$21.G 50.4,10.4 v51,11
N$5
  Top 0.152: U$49.P$2 37.94,13.05 37.94,11.84 37.03,10.92 M1_LED.A
N$6
  Top 0.508: U$9.P$1 44,22 44.46,22.46 U$5.HO
N$7
  Top 0.508: U$5.LO 45.1,25 42.5,22.39 U$12.P$2
N$8  (via drill 0.35)
  Top 0.508: v61,10.39 51.5,10.39 51.33,10.21 50.4,10.21 U$12.P$1
  Bottom 0.508: U$11.P$2 60,11.89 U$22.G 60.01,10.39 v61,10.39
N$9  (via drill 0.35)
  Top 0.508: v59.2,21 57.85,21 | 57.85,21 U$13.VB | U$14.P$2 57.85,19.57 57.85,21
  Bottom 0.508: U$16.P$1 60,21.8 v59.2,21
N$10  (via drill 0.35)
  Top 0.508: U$17.P$2 54.89,17 v51,17
  Bottom 0.508: U$18.P$2 50,17.89 U$23.G 50.4,16.4 v51,17
N$11
  Top 0.508: U$17.P$1 56,22 56.46,22.46 U$13.HO
N$12
  Top 0.508: U$20.P$2 54.5,22.5 57,25 U$13.LO
N$13  (via drill 0.35)
  Top 0.508: U$20.P$1 54.5,18.5 55,19 v57,19
  Bottom 0.508: U$19.P$2 60,17.89 U$24.G 59.6,16.4 v57,19
N$14  (via drill 0.35)
  Top 0.152: U$95.P$1 62.02,7.87 63.93,7.87 U$96.P$1 64.08,7.87 66.44,7.87 69.41,10.84 70.86,10.84 M2.2
  Top 0.508: v59.1,24.5 59.1,24.17 58.66,23.73 U$13.VS
  Bottom 0.508: U$23.S 51.89,17.01 U$18.P$1 52.09,18 58.59,24.5 v59.1,24.5 59.5,24.5 U$16.P$2
  Bottom 0.813: U$24.DD 53.95,15.45 53.7,15.7 53,16.4 U$23.S | U$24.DD U$24.DDD U$24.DDDD | U$24.DDDD U$24.D U$24.DD | 63,14.5 U$24.DDDD
  Bottom 1.27: M2.2 67.27,14.5 63,14.5 | 53.7,15.7 58.8,15.7 U$24.D
N$15  (via drill 0.35)
  Top 0.508: v31.1,21 29.85,21 U$25.VB 29.66,19.77 U$26.P$2
  Bottom 0.508: U$28.P$1 v31.1,21
N$16  (via drill 0.35)
  Top 0.152: M3_F.A 17.98,2.16 15.01,2.16 M3_B.K 15.01,2.23 15.01,2.46 9.29,8.18 9.29,10.54 M3.1
  Top 0.508: U$25.VS 30.83,23.73 v31.1,24 32,23.1 32,17 33,16 33,14.5 v32,13.5
  Top 1.27: v13,17 9.12,13.12 M3.1
  Bottom 0.508: U$41.S 31.11,14.49 U$30.P$1 v32,13.5 | U$28.P$2 v31.1,24
  Bottom 0.61: U$42.DD U$42.DDD U$42.DDDD
  Bottom 0.813: U$42.DD U$42.D U$42.DDDD | U$41.S 29,15.1
  Bottom 1.27: U$42.DDDD v13,17 | 29,15.1 27,15.1 25.1,17 U$42.D
N$17  (via drill 0.35)
  Top 0.508: U$29.P$2 31.11,15 v32,15
  Bottom 0.508: U$30.P$2 32.89,14.99 32.9,15 | 32.9,15 U$41.G | 32.9,15 v32,15
N$18
  Top 0.152: M2_LED.A U$50.P$2
N$19
  Top 0.508: U$25.HO 28.46,22.46 28,22 U$29.P$1
N$20
  Top 0.508: U$32.P$2 26.5,22.5 29,25 U$25.LO
N$21
  Top 0.152: U$51.P$2 42.06,13.05 42.06,11.84 42.97,10.92 M3_LED.A
N$22  (via drill 0.35)
  Top 0.508: v23,14 26.5,17.5 U$32.P$1
  Bottom 0.508: U$31.P$2 21.89,14.99 U$42.G 23,14.1 v23,14
N$23  (via drill 0.35)
  Top 0.508: U$34.P$2 17.66,19.77 U$33.VB 18.91,21.19 v19.1,21
  Bottom 0.508: U$36.P$1 v19.1,21
N$24  (via drill 0.35)
  Top 0.508: U$37.P$2 16.3,17.81 16.34,17.81 25.15,9 v32,9
  Bottom 0.508: U$38.P$2 32.89,8.99 | 32.89,8.99 U$43.G | v32,9 v32.01,8.99 32.89,8.99
N$25
  Top 0.508: U$37.P$1 16,22 16.46,22.46 U$33.HO
N$26
  Top 0.508: U$40.P$2 14.5,22.5 17,25 U$33.LO
N$27  (via drill 0.35)
  Top 0.508: v21,9 21,11.15 14.5,17.65 U$40.P$1
  Bottom 0.508: U$39.P$2 21.89,8.99 U$44.G 21.9,9 v21,9
N$28
  Top 0.152: U$52.P$2 35.96,13.05 35.5,13.05 34.06,11.61 34.06,10.92 +3.3V.A
N$29
  Bottom 1.27: CN1.1 26.68,4 U$102.P$1
N$30
  Top 0.152: U$57.P$2 33.98,3.91 33.98,5.05 +12V.A
N$31  (via drill 0.35)
  Top 0.152: U$98.P$1 17.98,7.87 16.07,7.87 U$97.P$1 15.92,7.87 12.11,7.87 10.89,9.09 M3.2
  Top 0.508: U$33.VS 18.83,23.73 v19.1,24 20,23.1 20,15.08 25.12,9.97 v26,9.97
  Bottom 0.508: U$38.P$1 31.11,8.49 U$43.S | U$36.P$2 v19.1,24
  Bottom 0.813: 29.45,9.1 U$43.S | U$44.DDD U$44.DDDD U$44.D U$44.DD U$44.DDD
  Bottom 1.27: M3.2 12.77,11 U$44.DDDD | U$44.D 24.97,11 v26,9.97 28.58,9.97 29.45,9.1
N$32  (via drill 0.35)
  Top 0.508: U$65.P$2 34.34,55.23 U$64.VB 32.79,53.81 v32.7,53.9
  Bottom 0.508: v32.7,53.9 31.9,53.1 U$75.P$1
N$33
  Top 0.152: U$59.P$2 15.77,35 13.79,35 LED_1.A
N$34
  Top 0.152: U$56.P$2 44.04,13.05 44.04,12.83 45.94,10.92 M4_LED.A
N$35  (via drill 0.35)
  Top 0.508: U$46.P$2 50.34,55.23 U$45.VB 49.09,53.81 49,53.9 v48.8,53.9
  Bottom 0.508: v48.8,53.9 U$48.P$1
N$36  (via drill 0.35)
  Top 0.152: M1_B.K 77.87,52.07 77.87,54.96 M1_F.A 77.8,54.96 77.57,54.96 73.45,59.08 70.94,59.08 M1.1
  Top 0.508: U$45.VS 50.07,51 v48.9,51 48,51.9 48,62 v49,63
  Bottom 0.508: U$1.S 49.89,60.51 U$55.P$1 49.89,62.11 v49,63 | U$48.P$2 48,50.9 48.8,50.9 v48.9,51
  Bottom 0.61: U$2.DDDD U$2.DDD U$2.DD
  Bottom 0.813: U$2.DDDD U$2.D U$2.DD | U$1.S 52,59.9
  Bottom 1.27: M1.1 69.77,58 U$2.DDDD | 52,59.9 56.1,59.9 U$2.D
N$37
  Top 0.152: U$61.P$2 15.77,40.03 13.79,40.03 LED_3.A
N$38
  Top 0.152: U$60.P$2 15.77,37.52 13.79,37.52 LED_2.A
N$39  (via drill 0.35)
  Top 0.508: U$54.P$2 49,59.89 v49,60
  Bottom 0.508: U$55.P$2 48,61.39 U$1.G 48.9,59.9 v49,60
N$40
  Top 0.508: U$54.P$1 52,53 51.54,52.54 U$45.HO
N$41
  Top 0.508: U$45.LO 51,50 53.5,52.5 U$63.P$2
N$42  (via drill 0.35)
  Top 0.508: U$63.P$1 53.5,57.5 v57,61
  Bottom 0.508: U$2.G 58,61 | 58,61 58,61.39 U$62.P$2 | v57,61 58,61
N$43  (via drill 0.35)
  Top 0.508: U$67.P$2 62.34,55.23 U$66.VB 62.25,53.9 v60.7,53.9
  Bottom 0.508: v60.7,53.9 U$69.P$1
N$44  (via drill 0.35)
  Top 0.152: M4_B.K 2.13,52.07 2.13,54.96 M4_F.A 2.2,54.96 2.43,54.96 8.3,60.83 10.82,60.83 M4.1
  Top 0.508: U$64.VS 34.07,51 v32.9,51 31.28,52.62 31.28,56.64 31,56.92 31,57 29,59 v29,62
  Bottom 0.508: U$88.S 28.11,63.99 U$77.P$1 29,62.11 v29,62 | U$75.P$2 v32.9,51
  Bottom 0.813: U$88.S 26.6,64.6 | U$89.DDD U$89.DD U$89.D U$89.DDDD U$89.DDD
  Bottom 1.27: M4.1 10.88,61.88 15.5,66.5 U$89.DDDD | U$89.D 24.7,66.5 26.6,64.6
N$45  (via drill 0.35)
  Top 0.508: U$70.P$2 60,60.89 60,64.11 59.11,65 50,65 v49,66
  Bottom 0.508: U$71.P$2 48,67.39 U$3.G 48.1,66 v49,66
N$46
  Top 0.508: U$66.HO 63.54,52.54 64,53 U$70.P$1
N$47
  Top 0.508: U$73.P$2 65.5,52.5 63,50 U$66.LO
N$48  (via drill 0.35)
  Top 0.508: v59,66 60,66 61.19,64.81 61.19,61.66 65.5,57.35 U$73.P$1
  Bottom 0.508: U$72.P$2 58,67.39 U$4.G 58.1,66 v59,66
N$49  (via drill 0.35)
  Top 0.508: U$76.P$2 36,58 v31,63
  Bottom 0.508: U$88.G 29.89,64.49 U$77.P$2 v31,63
N$50
  Top 0.508: U$64.HO 35.54,52.54 36,53 U$76.P$1
N$51
  Top 0.508: U$79.P$2 37.5,52.5 35,50 U$64.LO
N$52  (via drill 0.35)
  Top 0.508: v21,63 22,64 32,64 37.5,58.5 U$79.P$1
  Bottom 0.508: U$89.G 20,63.11 U$78.P$2 v21,63
N$53  (via drill 0.35)
  Top 0.508: U$81.P$2 22.34,55.23 U$80.VB 22.15,54 v20.7,54
  Bottom 0.508: v20.7,54 19.9,53.2 U$83.P$1
N$54  (via drill 0.35)
  Top 0.508: U$84.P$2 24.89,56 v29,56
  Bottom 0.508: U$90.G 29.89,58.49 U$85.P$2 29.89,56.89 v29,56
N$55
  Top 0.508: U$80.HO 23.54,52.54 24,53 U$84.P$1
N$56
  Top 0.508: U$87.P$2 25.5,52.5 23,50 U$80.LO
N$57  (via drill 0.35)
  Top 0.508: U$87.P$1 24.53,57.86 v20.86,57.86
  Bottom 0.508: U$86.P$2 19.89,58.49 U$91.G 20.74,57.86 v20.86,57.86
N$58  (via drill 0.35)
  Top 0.152: U$99.P$1 7.92,52.07 7.92,53.97 U$104.P$1 7.92,54.05 7.92,57.94 9.06,59.08 M4.2
  Top 0.508: U$80.VS 22.07,51 v20.9,51 19.28,52.62 19.28,56.64 19,56.92 v19,59.55
  Bottom 0.508: U$85.P$1 28.11,57.99 U$90.S | v20.9,51 U$83.P$2
  Bottom 0.813: U$90.S 26.5,58.6 | U$91.DDD v19,59.55 U$91.DD U$91.D U$91.DDDD U$91.DDD
  Bottom 1.27: M4.2 9.12,59.06 9.26,58.92 14.72,58.92 16.3,60.5 U$91.DDDD | 26.5,58.6 24.6,60.5 U$91.D
N$59
  Top 0.152: U$92.P$1 32.08,2.16 33.98,2.16 U$57.P$1
N$60
  Top 0.152: U$93.P$2 73.91,51.99 M1_B.A
N$61
  Top 0.152: U$94.P$2 73.91,54.05 75.2,54.05 76.12,54.96 M1_F.K
N$62
  Top 0.152: U$95.P$2 62.02,6.04 62.02,3.91 M2_B.A
N$63  (via drill 0.35)
  Top 0.152: 36,9.09 35.66,9.09 34.13,9.09 +3.3V.K | 36.95,9.09 M1_LED.K | M3_LED.K 42.97,9.17 40,9.17 M2_LED.K | LED_1.K 12.04,35 12.04,37.44 LED_2.K 12.04,37.52 12.04,40 12.04,40.03 LED_3.K 12.04,40.11 12.04,42.54 LED_4.K 11.96,42.62
  Top 0.279: U$53.P$3 9.58,45 11.96,42.62 | LED_4.K 12.04,42.56 12.04,40 | LED_3.K 12.04,40.02 12.04,37.52 12,37.48 LED_1.K 14.67,32.3 14.67,27.72 14.17,27.22 v14.17,27.07 | v35.66,12.29 35.66,9.09 | +12V.K +3.3V.K 34.03,9.09 36,9.09 36.95,9.09 | M1_LED.K 37.04,9.17 40,9.17 | M2_LED.K M3_LED.K M4_LED.K
  Bottom 0.279: v14.17,27.07 19.39,27.07 27.8,18.67 35.28,18.67 35.67,18.28 35.67,17.72 35.66,17.71 v35.66,12.29
N$65
  Top 0.152: U$100.P$2 15.77,42.62 13.79,42.62 LED_4.A
N$68
  Top 0.152: U$97.P$2 16,6.04 16,4.9 15.01,3.91 M3_B.A
N$69
  Top 0.152: U$96.P$2 64,6.04 64,4.9 64.99,3.91 M2_F.K
N$70
  Top 0.152: U$99.P$2 6.09,51.99 M4_B.A
N$71
  Top 0.152: U$104.P$2 6.09,54.05 4.8,54.05 3.88,54.96 M4_F.K
N$72
  Top 0.152: U$98.P$2 17.98,6.04 17.98,3.91 M3_F.K
N$86
  Top 0.152: U$107.P$2 47.31,32.33 45.49,32.33 44.42,33.4 U2.31
N$87
  Top 0.279: U2.2 45.83,38 53.99,38 53.99,37.99 | 53.99,37.99 U$112.P$1 | U$113.P$1 56.34,40.34 53.99,37.99
N$88
  Top 0.279: U2.3 48.77,42.08 48.77,43 | 48.77,43 U$112.P$2 | U$114.P$1 50.83,43 48.77,43
PLED_1  (via drill 0.35)
  Top 0.152: v37.94,20.6 37.94,14.96 U$49.P$1 | v33.83,30.35 v33.83,27.38 | v34.67,32.48 35.58,33.4 U2.18
  Bottom 0.152: v37.94,20.6 33.83,24.71 v33.83,27.38 | v33.83,30.35 33.83,31.65 v34.67,32.48
PLED_2  (via drill 0.35)
  Top 0.152: v40,24.18 U$50.P$1 | v40,26.24 40,26.69 36.88,29.82 36.88,31.34 37.26,31.72 U2.21
  Bottom 0.152: v40,26.24 v40,24.18
PLED_3  (via drill 0.35)
  Top 0.152: v41.98,16.56 41.98,14.96 U$51.P$1 | v41.22,25.93 37.48,29.67 37.48,30.73 37.87,31.11 U2.22
  Bottom 0.152: v41.98,16.56 41.98,25.17 v41.22,25.93
PLED_4  (via drill 0.35)
  Top 0.152: v47.01,20.06 47.16,19.91 47.16,18.46 46.93,18.24 45.87,18.24 45.49,18.62 41.91,18.62 41.75,18.46 41.75,17.7 43.96,15.49 43.96,14.96 U$56.P$1 | v47.01,27.76 45.33,27.76 43.12,29.97 43.12,31.34 42.74,31.72 U2.28
  Bottom 0.152: v47.01,20.06 47.16,20.06 48.69,21.59 48.69,26.09 v47.01,27.76
RST  (via drill 0.35)
  Top 0.152: 42.86,36.64 44.5,35 49.91,35 51.89,33.02 63.09,33.02 65.91,35.84 | 42.86,36.64 42.82,36.68 42.82,36.91 43.2,37.29 43.2,37.67 U2.4 | 65.91,35.84 70.71,40.64 70.71,43.29 U$111.P$1 72.85,44 S2.1 S2.2 | v6.24,24.1 5.18,23.04 2.05,23.04 X1.5 | 42.86,36.64 v40.61,34.39 | 65.91,35.84 76.19,25.55 SV2.5
  Bottom 0.152: U$106.P$1 78.33,23.95 77.8,23.95 76.27,25.48 SV2.5 | v6.24,24.1 11.58,29.44 35.66,29.44 v40.61,34.39
RX  (via drill 0.35)
  Top 0.152: X1.4 TP10.TP 9,21 v19,31 | v20.5,30.5 21,31 35.43,31 U2.20
  Bottom 0.152: v19,31 19.5,30.5 v20.5,30.5
SCL  (via drill 0.35)
  Top 0.152: X1.6 TP11.TP v8.2,25 | U2.29 44.89,30.67 v44.89,30
  Bottom 0.152: v8.2,25 9,25 12.61,28.61 14.25,28.61 14.55,28.3 43.2,28.3 v44.89,30
SDA  (via drill 0.35)
  Top 0.152: X1.7 TP12.TP 8,28 v14,28 | v45,29 45.5,29.5 45.5,31.2 U2.30
  Bottom 0.152: v45,29 44,28 v14,28
SWO
  Top 0.152: U2.26 41.6,30.58 41.98,30.58 45.41,27.15 49.45,27.15 50.52,28.22 71.01,28.22 73.68,25.55 SV2.6
TCK
  Top 0.152: U2.24 39.09,30.05 40.23,30.05 43.43,26.85 49.6,26.85 50.67,27.91 70.02,27.91 73.98,23.95 74.14,23.95 74.67,23.42 74.67,21.44 73.76,20.52 SV2.2
TMS
  Top 0.152: U2.23 38.4,30.58 38.4,30.2 38.02,29.82 38.02,29.59 41.07,26.54 50.21,26.54 50.67,26.09 52.34,26.09 52.8,26.54 62.17,26.54 63.09,25.63 71.09,25.63 73.68,23.04 SV2.4
TX
  Top 0.152: U2.19 34.8,31.5 20.5,31.5 8.5,19.5 TP9.TP 2.5,19.5 X1.3
VDD  (via drill 0.35)
  Top 0.279: v35,18 34.89,17.78 34.89,13.28 32.69,11.07 32.69,4.52 32.08,3.91 U$92.P$2
  Top 0.508: U$7.P$1 64.19,21.19 U$13.VCC 61.58,20.43 U$14.P$1 61.49,19 v57,14.51 | U$15.P$1 52.19,21.19 U$5.VCC 49.58,20.43 U$6.P$1 48.71,18.14 v48.71,17.11 | U$82.P$1 36.19,21.19 U$25.VCC 33.58,20.43 U$26.P$1 34,19 v35,18 | U$27.P$1 24.19,21.19 U$33.VCC 21.57,20.43 U$34.P$1 v25,19 | U$74.P$1 15.81,53.81 16,53.81 | 16,53.81 U$80.VCC 18.43,54.58 U$81.P$1 | U$35.P$1 27.81,53.81 28.19,53.81 | U$65.P$1 30.43,54.58 U$64.VCC 28.19,53.81 | U$47.P$1 43.81,53.81 U$45.VCC 46.42,54.58 U$46.P$1 46,56.42 v46,58 | U$67.P$1 58.42,54.58 U$66.VCC 55.81,53.81 | U$68.P$1 55.81,53.81 | 16,53.81 16,54 v17,55 | v27,55 28.19,53.81 | v55,55 55.81,54.19 55.81,53.81
  Bottom 0.279: U$21.DDD 52.5,9.47 52.5,9.43
  Bottom 0.508: v25,19 27.85,16.15 30.4,16.15 U$41.DDD | U$41.D 34,17 v35,18 | U$23.DDDD 56.99,14.5 v57,14.51 | v17,55 v27,55 30,55 31,56 31,59.55 | U$1.DDDD 52,58 v55,55
  Bottom 0.61: U$90.DDDD U$90.DDD U$90.DD | U$43.DD U$43.DDD U$43.DDDD | U$41.DDDD U$41.DDD U$41.DD | U$88.DDDD U$88.DDD U$88.DD | U$23.DD U$23.DDD U$23.DDDD | U$1.DD U$1.DDD U$1.DDDD
  Bottom 0.813: U$21.D U$21.DD 52.09,9.45 52.1,9.43 52.5,9.43 U$21.DDDD U$21.D | U$43.DDDD U$43.D U$43.DD | U$41.DDDD U$41.D U$41.DD | U$23.DD U$23.D U$23.DDDD | U$21.D 49.5,9 48.7,9 | U$90.DDDD U$90.D U$90.DD 31,59.55 | U$88.DDDD U$88.D U$88.DD | U$1.DD U$1.D U$1.DDDD | U$3.DD U$3.D U$3.DDDD U$3.DDD U$3.DD
  Bottom 1.27: 48.7,9 48.7,14.3 | U$23.D 49.5,14.5 49,14 48.7,14.3 | 42,57 39,54 39,38.72 49.55,28.16 49.55,20.96 48.7,20.11 v48.7,17.12 v48.71,17.11 48.71,14.31 48.7,14.3 | 42,57 45,57 v46,58 | v46,58 U$1.D | U$90.D 32.05,60.5 33,59.55 | 33,59.55 39.45,59.55 42,57 | U$88.D 31.5,66.5 33,65 33,59.55 | U$3.D 46,62 v46,58 | U$43.D 34,10 | 34,10 34.49,9.51 34.49,15.51 U$41.D | 34,10 34,9.87 34.14,9.74 34.14,6.87 | 34.14,6.87 33.46,6.19 29.13,6.19 U$102.P$2 | 34.14,6.87 36.13,8.86 49.64,8.86 U$21.D | U$101.P$1 56.51,5.51 53.52,8.5 U$21.DDDD

### Text on the board
tPlace: OFF | LED | ON